# Altium project PCB_Pulsador_RGB.PrjPcb
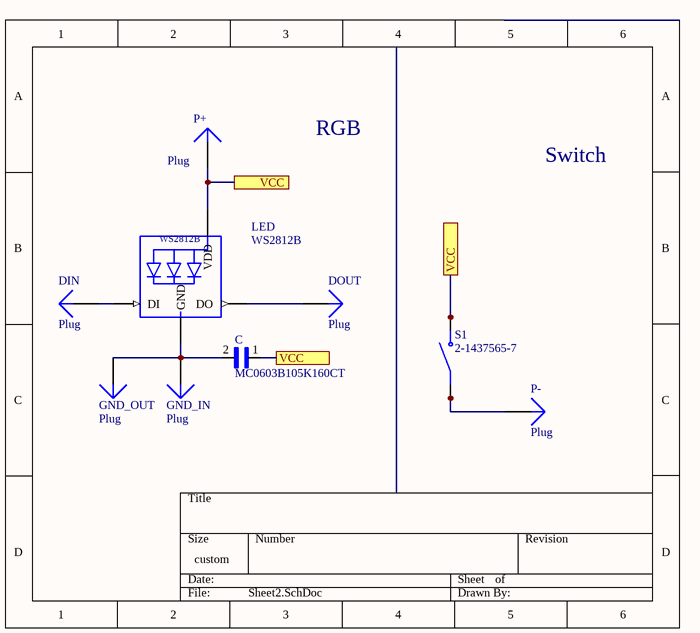
[diagram p0: Sheet2.SchDoc]
1 sheet, 9 parts. Net scope: flat (ports and power ports of the same name join across sheets).
Board file: PCB2.PcbDoc

## Sheet Sheet2.SchDoc
size 127 x 114 mm

### Parts
C  MC0603B105K160CT  [CAPC1608X87N]
DIN  Plug  [PIN1]
DOUT  Plug  [PIN1]
GND_IN  Plug  [PIN1]
GND_OUT  Plug  [PIN1]
LED  WS2812B  [LED_WS2812B-B]
P+  Plug  [PIN1]
P-  Plug  [PIN1]
S1  2-1437565-7  [SW_2-1437565-7]

### Ports
VCC

### Nets
NetC_1: C.1 LED.1-VDD(VDD) P+.1 S1.3(NO) S1.4(NO) ; port VCC
NetC_2: C.2 GND_IN.1 GND_OUT.1 LED.3-GND(GND)
NetDIN_1: DIN.1 LED.4-DIN(DI)
NetDOUT_1: DOUT.1 LED.2-DOUT(DO)
NetP-_1: P-.1 S1.1(COM) S1.2(COM)

### Notes on the sheet
- RGB
- Switch

### Library data of the parts
C = MC0603B105K160CT: Cap, Mlcc, X7r, 1uf, 16v, 0603; MF: Multicomp; SnapEDA_Link: https://www.snapeda.com/parts/MC0603B105K160CT/Multicomp/view-part/276886/?ref=snap; Value: *; Price: None; Availability: Unavailable; MP: MC0603B105K160CT; Package: 0603 Multicomp
LED = WS2812B: Raspberry Pi HAT _40 pin_ Wheeled Robotics Kit; pin to pad: 1-VDD>1 2-DOUT>2 3-GND>3 4-DIN>4; MF: SparkFun Electronics; Availability: Unavailable; SnapEDA_Link: https://www.snapeda.com/parts/WS2812B/Worldsemi/view-part/1038297/?ref=snap; MP: WS2812B; Price: None; Value: *; Package: None
S1 = 2-1437565-7: Tactile Switch SPST-NO Top Actuated Surface Mount; MF: TE Connectivity; Contact_Current_Rating: 50 mA; Configuration_Pole-Throw: Single Pole - Single Throw; MP: 2-1437565-7; SnapEDA_Link: https://www.snapeda.com/parts/2-1437565-7/TE%20Connectivity%20ALCOSWITCH%20Switches/view-part/214770/?ref=snap; TE_purchase_URL: https://www.te.com/usa-en/product-2-1437565-7.html?te_bu=Cor&te_type=disp&te_campaign=seda_glo_cor-seda-global-disp-prtnr-fy19-seda-model-bom-cta_sma-317_1&elqCampaignId=32493; Value: *; Package: None; Price: None; Availability: Unavailable
DIN DOUT GND_IN GND_OUT P+ P- = Plug: LatestRevisionDate: 17-Jul-2002; LatestRevisionNote: Re-released for DXP Platform.; Publisher: Altium Limited